# Altium project slave_v2.PrjPcb (part 2 of 2)

## Sheet dcdc-converter.SchDoc
size A3; DocumentNumber: 9; SheetNumber: 9; SheetTotal: 11; SheetDescription: DC/DC-Converter
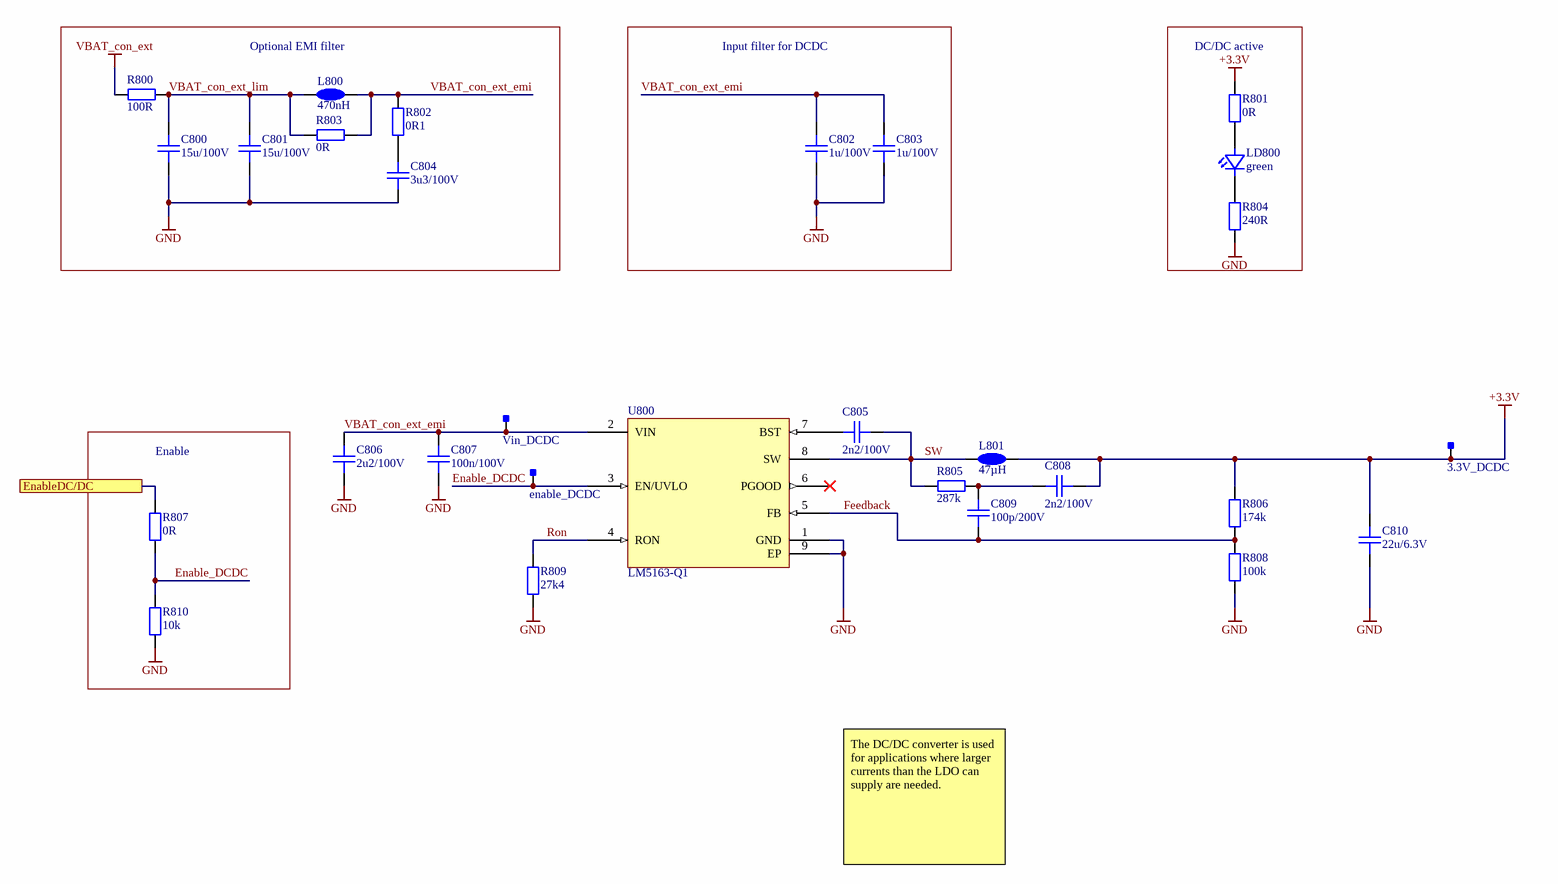
[diagram p5: dcdc-converter.SchDoc]

### Parts
3.3V_DCDC  Testpoint_Square  [Testpoint_S1]  (value not drawn)  (no BOM)
C800  15u/100V  [CAPC6153X67N]
C801  15u/100V  [CAPC6153X67N]
C802  1u/100V  [CAPC3225X25N]
C803  1u/100V  [CAPC3225X25N]
C804  3u3/100V  [CAPC4532X16N]
C805  2n2/100V  [CAPC1005X06N]
C806  2u2/100V  [CAPC3225X25N]
C807  100n/100V  [CAPC1608X08N]
C808  2n2/100V  [CAPC1005X06N]
C809  100p/200V  [CAPC1005X06N]
C810  22u/6.3V  [CAPC3216X18N]
enable_DCDC  Testpoint_Square  [Testpoint_S1]  (value not drawn)  (no BOM)
L800  470nH  [SRP7028A]
L801  47µH  [TYS6045470M-10]
LD800  green  [LEDC1608X07N]
R800  100R  [RESC1608X05N]
R801  0R  [RESC1608X05N]
R802  0R1  [RESC2012X05N]
R803  0R  [RESC1608X05N]
R804  240R  [RESC1608X05N]
R805  287k  [RESC1608X05N]
R806  174k  [RESC1608X05N]
R807  0R  [RESC1608X05N]
R808  100k  [RESC1608X05N]
R809  27k4  [RESC1608X05N]
R810  10k  [RESC1608X05N]
U800  LM5163-Q1  [R-PDSO-G8]
Vin_DCDC  Testpoint_Square  [Testpoint_S1]  (value not drawn)  (no BOM)

### Blocks framed on the sheet
Optional EMI filter: C800 C801 C804 L800 R800 R802 R803
Input filter for DCDC: C802 C803
DC/DC active: LD800 R801 R804
Enable: R807 R810

### Ports
EnableDC/DC

### Nets
+3.3V: 3.3V_DCDC.1 C808.2 C810.2 L801.2 R801.2 R806.2
GND: C800.1 C801.1 C802.1 C803.1 C804.1 C806.1 C807.1 C810.1 R804.1 R808.1 R809.1 R810.2 U800.1(GND) U800.9(EP)
VBAT_con_ext: R800.1
Enable_DCDC: enable_DCDC.1 R807.2 R810.1 U800.3(EN/UVLO)
Feedback: C809.1 R806.1 R808.2 U800.5(FB)
Ron: R809.2 U800.4(RON)
SW: C805.2 L801.1 R805.1 U800.8(SW)
VBAT_con_ext_emi: C802.2 C803.2 C806.2 C807.2 L800.2 R802.2 R803.2 U800.2(VIN) Vin_DCDC.1
VBAT_con_ext_lim: C800.2 C801.2 L800.1 R800.2 R803.1
NetC804_2: C804.2 R802.1
NetC805_1: C805.1 U800.7(BST)
NetC808_1: C808.1 C809.2 R805.2
NetLD800_1: LD800.1(C) R804.2
NetLD800_2: LD800.2(A) R801.1
NetR601_2: R807.1 ; port EnableDC/DC

Not connected (* = marked no-connect by the designer): U800 6(PGOOD)*

### Notes on the sheet
- The DC/DC converter is used for applications where larger currents than the LDO can supply are needed.
- Fraunhofer IISB
- Schottkystr. 10
- developed by:
- 91058 Erlangen
- Germany
- Author
- Project
- License
- Description
- File
- Version
- Release Date
- Sheet
- foxbms.org <https://foxbms.org>
- www.iisb.fraunhofer.de <https://www.iisb.fraunhofer.de/>
- foxBMS Team
- /

### Library data of the parts
3.3V_DCDC enable_DCDC Vin_DCDC = Testpoint_Square: Testpoint, square; Automotive Qualified: False; Part Number: Testpoint_Square
C800 C801 = gen_C_ceramic_15u_100V_X7R_2220: Stacked MLCC; Capacitance: 15u; Rated Voltage: 100V; Dielectric: X7R; Case EIA: 2220; Case Metric: 5750; Automotive Qualified: True; Part Number: gen_C_ceramic_15u_100V_X7R_2220; Supplier 1: Farnell; Supplier Part Number 1: 2781468; Supplier 2: Digikey; Supplier Part Number 2: 490-5838-1-ND; Supplier 3: Mouser; Supplier Part Number 3: 81-KCM55WR72A156MH1K
C802 C803 = gen_C_ceramic_1u_100V_X7R_1210: MLCC; Capacitance: 1u; Rated Voltage: 100V; Dielectric: X7R; Case EIA: 1210; Case Metric: 3225; AVT Set: x; Automotive Qualified: True; Part Number: gen_C_ceramic_1u_100V_X7R_1210; Supplier 1: Farnell; Supplier Part Number 1: 1301722
C804 = gen_C_ceramic_3u3_100V_X7R_1812: MLCC; Capacitance: 3u3; Rated Voltage: 100V; Dielectric: X7R; Case EIA: 1812; Case Metric: 4532; Automotive Qualified: True; Part Number: gen_C_ceramic_3u3_100V_X7R_1812; Supplier 1: Farnell; Supplier Part Number 1: 2579025; Supplier 2: Digikey; Supplier Part Number 2: 399-13376-1-ND; Supplier 3: Mouser; Supplier Part Number 3: 80-C1812C335K1RAUTO
C805 = gen_C_ceramic_2n2_100V_X7R_0402: MLCC; Capacitance: 2n2; Rated Voltage: 100V; Dielectric: X7R; Case EIA: 0402; Case Metric: 1005; Automotive Qualified: True; PnP Package: 0402C; Part Number: gen_C_ceramic_2n2_100V_X7R_0402; Supplier 1: Digikey; Supplier Part Number 1: 490-4911-1-ND
C806 = gen_C_ceramic_2u2_100V_X7R_1210: MLCC; Capacitance: 2u2; Rated Voltage: 100V; Dielectric: X7R; Case EIA: 1210; Case Metric: 3225; AVT Set: x; Automotive Qualified: True; Part Number: gen_C_ceramic_2u2_100V_X7R_1210; Supplier 1: Farnell; Supplier Part Number 1: 2781417; Supplier 2: Farnell; Supplier Part Number 2: 2579027
C807 = gen_C_ceramic_100n_100V_X7R_0603: MLCC; Capacitance: 100n; Rated Voltage: 100V; Dielectric: X7R; Case EIA: 0603; Case Metric: 1608; Automotive Qualified: True; PnP Package: 0603C; Part Number: gen_C_ceramic_100n_100V_X7R_0603; Supplier 1: Digikey; Supplier Part Number 1: 490-13420-1-ND; Supplier 2: Mouser; Supplier Part Number 2: 81-GCJ188R72A104KA1D
C808 = gen_C_ceramic_2n2_100V_X7R_0402: MLCC; Capacitance: 2n2; Rated Voltage: 100V; Dielectric: X7R; Case EIA: 0402; Case Metric: 1005; PnP Package: 0402C; Automotive Qualified: True; Part Number: gen_C_ceramic_2n2_100V_X7R_0402; Supplier 1: Digikey; Supplier Part Number 1: 490-4911-1-ND
C809 = gen_C_ceramic_100p_200V_C0G_0402: MLCC; Capacitance: 100p; Rated Voltage: 200V; Dielectric: C0G; Tolerance: 5%; Case EIA: 0402; Case Metric: 1005; PnP Package: 0402C; Automotive Qualified: True; Part Number: gen_C_ceramic_100p_200V_C0G_0402; Supplier 1: Farnell; Supplier Part Number 1: 2426878; Supplier 2: Digikey; Supplier Part Number 2: 399-11551-1-ND; Supplier 3: RS Components; Supplier Part Number 3: 8353949
C810 = gen_C_ceramic_22u_6V3_X7R_1206: MLCC; Capacitance: 22u; Rated Voltage: 6.3V; Dielectric: X7R; Case EIA: 1206; Case Metric: 3216; Automotive Qualified: True; Part Number: gen_C_ceramic_22u_6V3_X7R_1206; Supplier 1: Farnell; Supplier Part Number 1: 2672216; Supplier 2: Farnell; Supplier Part Number 2: 2211066
L800 = SRP7028A-R47M: FIXED IND 470NH 17.5A 4.2 MOHM; Manufacturer: Bourns Inc; Saturation Current: 26A; Automotive Qualified: True; Part Number: SRP7028A-R47M; Operating Temperature: -40°C - +150°C; ComponentLink1Description: Datasheet; ComponentLink1URL: https://www.bourns.com/docs/Product-Datasheets/SRP7028A.pdf; Inductance: 470nH; Rated Current: 17.5A; Supplier 1: Digikey; Supplier Part Number 1: SRP7028A-R47MCT-ND; Supplier 2: Farnell; Supplier Part Number 2: 2434106
L801 = TYS6045470M-10: Power Inductor; Manufacturer: Laird-Signal Integrity Products; Rated Current: 1.2A; Saturation Current: 1.4A; Automotive Qualified: True; Part Number: TYS6045470M-10; Operating Temperature: -55°C - +150°C; ComponentLink1Description: Datasheet; ComponentLink1URL: http://assets.lairdtech.com/home/brandworld/files/TYS6045470M-10.pdf; Inductance: 47µH; Supplier 1: Digikey; Supplier Part Number 1: 240-2745-1-ND
LD800 = LED_0603_green_AECQ: TLMG1100-GS08; Manufacturer: Vishay; Breakdown Voltage: 5V; Continuous Forward Current: 20mA; Forward Voltage @ 20mA: 2.1V; Automotive Qualified: True; Part Number: LED_0603_green_AECQ; Color: green; Supplier 1: Farnell; Supplier Part Number 1: 2293494; PnP Package: LED_0603; Operating Temperature: -40°C - 100°C; ComponentLink1Description: Datasheet; ComponentLink1URL: http://www.farnell.com/datasheets/2049164.pdf; Supplier 2: Digikey; Supplier Part Number 2: 751-1165-1-ND
R800 = gen_R_100R_0603: SMD Resistor 100R 0603; Tolerance: 1%; Power: 0.1W; Case EIA: 0603; Case Metric: 1608; Maximum Working Voltage: 75V; PnP Package: 0603R; Automotive Qualified: True; PnP equipped: x; Part Number: gen_R_100R_0603; Operating Temperature: -55°C - +155°C; Resistance: 100R; Series: E24, E96; PnP Value: 100R; Supplier 1: Digikey; Supplier Part Number 1: P100HCT-ND
R801 R803 R807 = gen_R_0R_0603: SMD Resistor 0R 0603; Power: 0.1W; Case EIA: 0603; Case Metric: 1608; Maximum Working Voltage: 75V; PnP Package: 0603R; Automotive Qualified: True; PnP equipped: x; Part Number: gen_R_0R_0603; Operating Temperature: -55°C - +155°C; Resistance: 0R; Series: Jumper; PnP Value: 0R; Supplier 1: Farnell; Supplier Part Number 1: 2616580
R802 = gen_R_0R1_0805: SMD Resistor 0R1 0805; Power: 250mW; Case EIA: 0805; Maximum Working Voltage: 150V; Automotive Qualified: True; Part Number: gen_R_0R1_0805; Operating Temperature: -55°C - +155°C; Resistance: 0R1; Supplier 1: Farnell; Supplier Part Number 1: 2824733; Supplier 2: Digikey; Supplier Part Number 2: CRM0805AJX-R100ELFCT-ND
R804 = gen_R_240R_0603: SMD Resistor 240R 0603; Tolerance: 1%; Power: 0.1W; Case EIA: 0603; Case Metric: 1608; Maximum Working Voltage: 75V; PnP Package: 0603R; Automotive Qualified: True; AEC-Q Norm: AEC-Q200; Part Number: gen_R_240R_0603; Operating Temperature: -55°C - +155°C; Resistance: 240R; Series: E24; PnP Value: 240R; Supplier 1: Mouser; Supplier Part Number 1: 667-ERJ-3EKF2400V; ECCN: EAR99
R805 = gen_R_287k_0603: SMD Resistor 287k 0603; Tolerance: 1%; Power: 0.1W; Case EIA: 0603; Case Metric: 1608; Maximum Working Voltage: 75V; PnP Package: 0603R; Automotive Qualified: True; AEC-Q Norm: AEC-Q200; Part Number: gen_R_287k_0603; Operating Temperature: -55°C - +155°C; Resistance: 287k; Series: E96; PnP Value: 287k; Supplier 1: Mouser; Supplier Part Number 1: 667-ERJ-3EKF2873V; ECCN: EAR99
R806 = gen_R_174k_0603: SMD Resistor 174k 0603; Tolerance: 1%; Power: 0.1W; Case EIA: 0603; Case Metric: 1608; Maximum Working Voltage: 75V; PnP Package: 0603R; Automotive Qualified: True; AEC-Q Norm: AEC-Q200; Part Number: gen_R_174k_0603; Operating Temperature: -55°C - +155°C; Resistance: 174k; Series: E96; PnP Value: 174k; Supplier 1: Mouser; Supplier Part Number 1: 667-ERJ-3EKF1743V; ECCN: EAR99
R808 = gen_R_100k_0603: SMD Resistor 100k 0603; Tolerance: 1%; Power: 0.1W; Case EIA: 0603; Case Metric: 1608; Maximum Working Voltage: 75V; PnP Package: 0603R; Automotive Qualified: True; PnP equipped: x; Part Number: gen_R_100k_0603; Operating Temperature: -55°C - +155°C; Resistance: 100k; Series: E24, E96; PnP Value: 100k; Supplier 1: Farnell; Supplier Part Number 1: 2303232
R809 = gen_R_27k4_0603: SMD Resistor 27k4 0603; Tolerance: 1%; Power: 0.1W; Case EIA: 0603; Case Metric: 1608; Maximum Working Voltage: 75V; PnP Package: 0603R; Automotive Qualified: True; AEC-Q Norm: AEC-Q 200; Part Number: gen_R_27k4_0603; Operating Temperature: -55°C - +155°C; Resistance: 27k4; Series: E96; PnP Value: 27k4; Supplier 1: Mouser; Supplier Part Number 1: 667-ERJ-3EKF2742V; ECCN: EAR99
R810 = gen_R_10k_0603: SMD Resistor 10k 0603; Tolerance: 1%; Power: 0.1W; Case EIA: 0603; Case Metric: 1608; Maximum Working Voltage: 75V; PnP Package: 0603R; Automotive Qualified: True; Part Number: gen_R_10k_0603; Operating Temperature: -55°C - +155°C; Resistance: 10k; Series: E24, E96; PnP Value: 10k; Supplier 1: Farnell; Supplier Part Number 1: 2073349
U800 = LM5163-Q1: 100-V Input, 0.5-A SynchronousBuck DC/DCConverterwith Ultra-lowIQ; Manufacturer: Texas Instruments; Automotive Qualified: True; Part Number: LM5163-Q1; Part Name: LM5163-Q1; Operating Temperature: -40°C - +125°C; ComponentLink1Description: Datasheet; ComponentLink1URL: http://www.ti.com/lit/ds/symlink/lm5163-q1.pdf; Supplier 1: Digikey; Supplier Part Number 1: 296-53561-1-ND; Supplier 2: Mouser; Supplier Part Number 2: 595-LM5163QDDARQ1

## Nets that join several sheets
+3.3V: connectors (J308.10 J309.10), dcdc-converter (6 pins)
GND: mc33775 (38 pins), eeprom (C400.1 U400.1 U400.2 U400.4), passive_balancing (14 pins), connectors (26 pins), dcdc-converter (14 pins)
VAUX: mc33775 (7 pins), passive_balancing (R700.2 R701.2), connectors (J308.12 J309.12)
VBAT_con: mc33775 (D600.2), connectors (j300.10)
VBAT_con_ext: mc33775 (9 pins), connectors (J311.1 J312.1), dcdc-converter (R800.1)
VBAT_ext: mc33775 (D601.2), connectors (J310.2)
VDDC: mc33775 (12 pins), connectors (J308.11 J309.11)
VDDIO: mc33775 (R616.2 R617.2 R637.1 U600.39), eeprom (C400.2 R400.2 R401.2 U400.8), connectors (J308.9 J309.9)
AL_IN._N: mc33775 (C616.2 D610.3 U601.12), connectors (J305.1)
AL_IN._P: mc33775 (C616.1 D610.1 D610.2 U601.11), connectors (J305.2)
AL_OUT._N: mc33775 (C614.1 R632.2), connectors (J306.1)
AL_OUT._P: mc33775 (C614.2 R628.2), connectors (J306.2)
ALARM_IN: mc33775 (ALARM_IN.1 Q602.D R607.1 R641.2), connectors (J308.7 J309.7)
ALARM_OUT: mc33775 (ALARM_OUT.1 R627.2 R634.1 U600.57), connectors (J308.8 J309.8)
BAL.CB_COM1: mc33775 (U600.37), connectors (j300.17)
BAL.CB_COM3: mc33775 (U600.34), connectors (j300.16)
BAL.CB_COM5: mc33775 (U600.31), connectors (j300.15)
BAL.CB_COM7: mc33775 (U600.28), connectors (j300.14)
BAL.CB_COM9: mc33775 (U600.25), connectors (j300.13)
BAL.CB_COM11: mc33775 (U600.22), connectors (j300.12)
BAL.CB_COM13: mc33775 (D603.2 U600.19), connectors (j300.11)
BAL.CB_HI2: mc33775 (U600.36), passive_balancing (R715.2 R729.2)
BAL.CB_HI4: mc33775 (U600.33), passive_balancing (R717.2 R731.2)
BAL.CB_HI6: mc33775 (U600.30), passive_balancing (R719.2 R733.2)
BAL.CB_HI8: mc33775 (U600.27), passive_balancing (R721.2 R735.2)
BAL.CB_HI10: mc33775 (U600.24), passive_balancing (R723.2 R737.2)
BAL.CB_HI12: mc33775 (U600.21), passive_balancing (R725.2 R739.2)
BAL.CB_HI14: mc33775 (U600.18), passive_balancing (R727.1 R741.1)
BAL.CB_LO0: mc33775 (U600.38), passive_balancing (R714.1 R728.1)
BAL.CB_LO2: mc33775 (U600.35), passive_balancing (R716.1 R730.1)
BAL.CB_LO4: mc33775 (U600.32), passive_balancing (R718.1 R732.1)
BAL.CB_LO6: mc33775 (U600.29), passive_balancing (R720.1 R734.1)
BAL.CB_LO8: mc33775 (U600.26), passive_balancing (R722.1 R736.1)
BAL.CB_LO10: mc33775 (U600.23), passive_balancing (R724.1 R738.1)
BAL.CB_LO12: mc33775 (U600.20), passive_balancing (R726.1 R740.1)
BAL_NTC0: mc33775 (R613.1), passive_balancing (C701.2 R702.1)
BAL_NTC1: mc33775 (R614.1), passive_balancing (C703.2 R703.1)
CIN0: passive_balancing (R706.1 R714.2 R728.2), connectors (j300.9)
CIN2: passive_balancing (5 pins), connectors (j300.8)
CIN4: passive_balancing (5 pins), connectors (j300.7)
CIN6: passive_balancing (5 pins), connectors (j300.6)
CIN8: passive_balancing (5 pins), connectors (j300.5)
CIN10: passive_balancing (5 pins), connectors (j300.4)
CIN12: passive_balancing (5 pins), connectors (j300.3)
CIN14: passive_balancing (R713.1 R727.2 R741.2), connectors (j300.2)
GPIO2_ext: mc33775 (R623.1), connectors (J308.1 J309.1)
GPIO3_ext: mc33775 (R624.1), connectors (J308.2 J309.2)
GPIO6_ext: mc33775 (R625.1), connectors (J308.3 J309.3)
GPIO7_ext: mc33775 (R626.1), connectors (J308.4 J309.4)
I2C.SCL: mc33775 (R615.1 R616.1), eeprom (U400.6), connectors (J308.5 J309.5)
I2C.SDA: mc33775 (R617.1 R620.1), eeprom (U400.5), connectors (J308.6 J309.6)
MUX_DATA2: slave-14-mc33775 (R100.2), mc33775 (R608.1)
NetR601_2: mc33775 (R601.2), dcdc-converter (R807.1)
TPL_H._N: mc33775 (R612.2), connectors (J301.1)
TPL_H._P: mc33775 (R610.2), connectors (J301.2)
TPL_L._N: mc33775 (R622.2), connectors (J302.1)
TPL_L._P: mc33775 (R619.2), connectors (J302.2)

## Assembly variants
foxBMS_14cell_BMS-Slave_NXP775A_minimal: not fitted ALARM_IN C200_1 C200_2 C201_1 C201_2 C202_2 C203_1 C203_2 C204_2 C205_2 C206_2 C207_2 C208_2 C209_2 C210_2 C211_2 C212_2 C213_2 C214_2 C215_2 C216_2 C217_2 C218_2 C219_2 C220_1 C220_2 C221_1 C221_2 C400 C614 C615 C616 C617 C618 C800 C801 C802 C803 C804 C805 C806 C807 C808 C809 C810 C850 C851 C852 C900 C920 C921 C922 C923 C924 C925 D601 D608 D609 D610 IC920 L800 L801 LD800 LD850 Q601 Q602 R100 R200_2 R201_1 R201_2 R202_1 R202_2 R203_1 R203_2 R204_1 R204_2 R205_1 R205_2 R206_2 R207_2 R208_2 R209_2 R210_2 R211_2 R212_2 R213_2 R214_2 R215_2 R216_2 R217_2 R218_2 R219_2 R220_2 R221_2 R222_2 R223_2 R224_2 R225_2 R226_2 R227_2 R228_2 R229_2 R230_1 R230_2 R231_1 R231_2 R232_1 R232_2 R400 R401 R516 R517 R518 R519 R520 R521 R522 R523 R524 R525 R601 R603 R606 R607 R608 R609 R613 R614 R615 R616 R617 R620 R623 R624 R625 R626 R628 R632 R634 R638 R641 R642 R643 R706 R707 R708 R709 R710 R711 R712 R713 R800 R801 R802 R803 R804 R805 R806 R807 R808 R809 R810 R850 R851 R852 R853 R854 R900 R901 R902 R903 R904 R905 R906 R907 R908 R909 R910 R911 R912 R913 R914 R915 R916 R917 R918 R919 R920 R921 R922 R923 R924 R925 R926 R927 R928 R929 R930 R931 R932 R933 U200_1 U200_2 U201_1 U201_2 U202_1 U202_2 U400 U601 U800 U850 U851 U900 U920 U921 U922
foxBMS_14cell_BMS-Slave_NXP775A: not fitted C800 C801 C802 C803 C804 C805 C806 C807 C808 C809 C810 C920 C921 C923 C924 C925 IC920 L800 L801 LD800 R100 R200_2 R201_1 R202_1 R202_2 R203_1 R204_2 R210_1 R210_2 R211_1 R211_2 R212_1 R212_2 R213_1 R213_2 R214_1 R214_2 R215_1 R215_2 R216_1 R216_2 R217_1 R217_2 R230_1 R230_2 R516 R517 R518 R519 R520 R521 R522 R523 R524 R525 R603 R623 R624 R625 R626 R629 R630 R631 R633 R635 R636 R639 R640 R800 R801 R802 R803 R804 R805 R806 R807 R808 R809 R810 R850 R851 R853 R900 R901 R902 R904 R905 R906 R907 R908 R909 R910 R911 R912 R913 R914 R915 R917 R918 R919 R920 R921 R922 R923 R924 R925 R926 R927 R928 R929 R930 R931 R932 R933 U202_1 U202_2 U800 U850 U920 U922